# Altium project sliding_wheel.PrjPcb
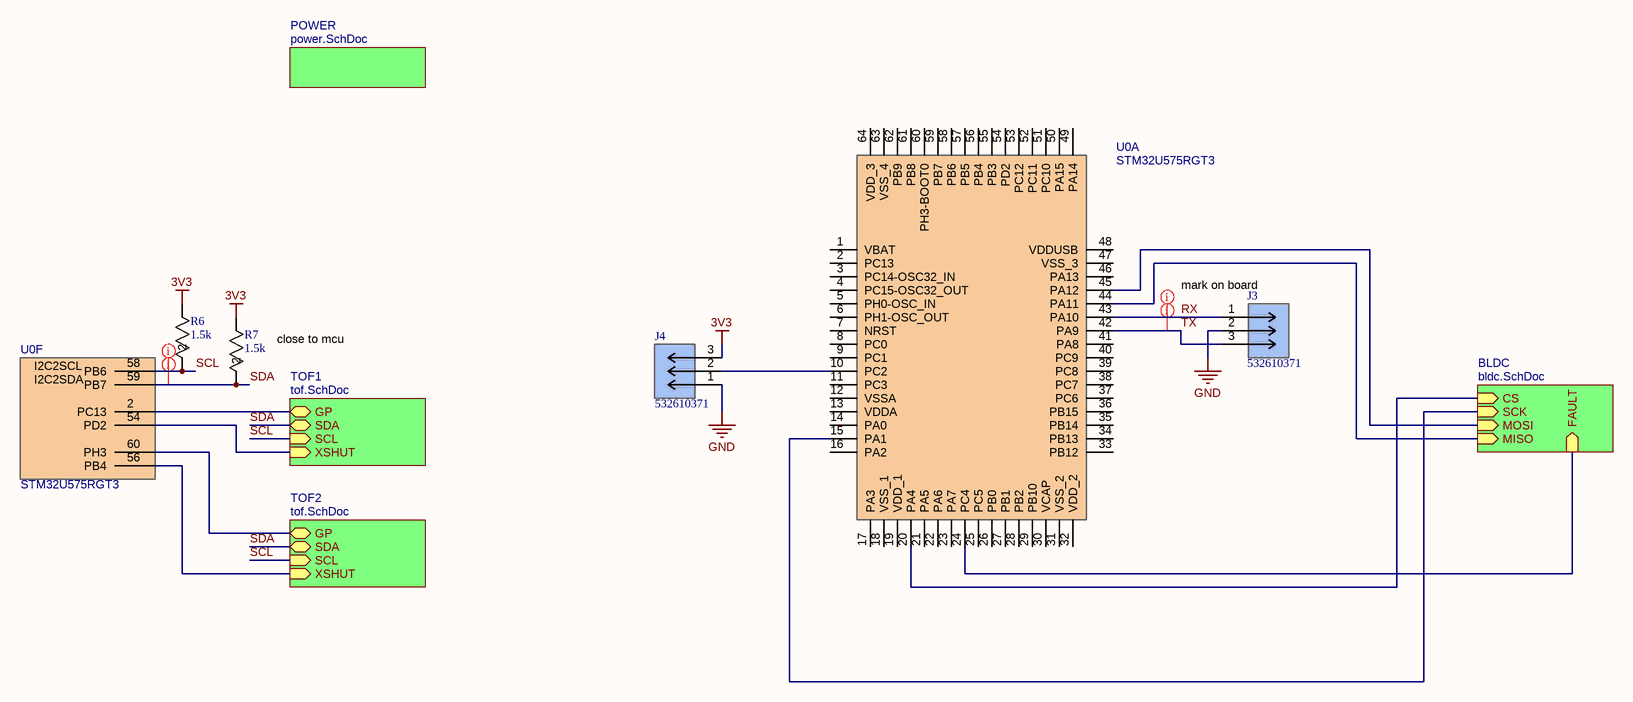
[diagram p0: main.SchDoc]
Author: Ben Posheng Cheng; Board: Sliding wheel
3 sheets, 55 parts. Net scope: hierarchical (ports join the sheet entries above them; power ports are global).
Board file: main.PcbDoc
Sheets:
  main.SchDoc
    BLDC = bldc.SchDoc
    POWER = power.SchDoc

## Sheet main.SchDoc
size Tabloid; SheetNumber: 1; SheetTotal: 4; Page: Main

### Parts
(Parts that share a designator on the sheet are numbered #1, #2 ... from top to bottom, then left to right.)
J3  532610371  [CONN_532610001-SD_03_MOL]
J4  532610371  [CONN_532610001-SD_03_MOL]
R6  1.5k  [RC0603N_YAG]
R7  1.5k  [RC0603N_YAG]
U0#1  STM32U575RGT3  [QFP50P1200X1200X160-64N]  (part A of 7)
U0#2  STM32U575RGT3  [QFP50P1200X1200X160-64N]  (part F of 6)

### Sub-sheets
BLDC = bldc.SchDoc: MISO (in), MOSI (in), SCK (in), CS (in), FAULT (in)
POWER = power.SchDoc: no entries
TOF1 = tof.SchDoc (file not in this document): GP (bidir), SDA (bidir), SCL (in), XSHUT (in)
TOF2 = tof.SchDoc (file not in this document): GP (bidir), SDA (bidir), SCL (in), XSHUT (in)

### Nets
3V3: J4.3 R6.1 R7.1
GND: J3.2 J4.1
CS: U0#1.20(PA4) ; sheet BLDC/CS
MOSI: U0#1.45(PA12) ; sheet BLDC/MOSI
RX: J3.1 U0#1.43(PA10)
SCL: R6.2 U0#2.58(PB6) ; sheet TOF1/SCL, sheet TOF2/SCL
SCL/SCK: U0#1.15(PA1) ; sheet BLDC/SCK
SDA: R7.2 U0#2.59(PB7) ; sheet TOF1/SDA, sheet TOF2/SDA
SDA/MISO: U0#1.44(PA11) ; sheet BLDC/MISO
TX: J3.3 U0#1.42(PA9)
NetJ4_2: J4.2 U0#1.10(PC2)
NetR12_2: U0#1.24(PC4) ; sheet BLDC/FAULT
NetU0#2_2: U0#2.2(PC13) ; sheet TOF1/GP
NetU0#2_54: U0#2.54(PD2) ; sheet TOF1/XSHUT
NetU0#2_56: U0#2.56(PB4) ; sheet TOF2/XSHUT
NetU0#2_60: U0#2.60(PH3) ; sheet TOF2/GP

Not connected (* = marked no-connect by the designer): U0#1 1(VBAT) 2(PC13) 3(PC14-OSC32_IN) 4(PC15-OSC32_OUT) 5(PH0-OSC_IN) 6(PH1-OSC_OUT) 7(NRST) 8(PC0) 9(PC1) 11(PC3) 12(VSSA) 13(VDDA) 14(PA0) 16(PA2) 17(PA3) 18(VSS_1) 19(VDD_1) 21(PA5) 22(PA6) 23(PA7) 25(PC5) 26(PB0) 27(PB1) 28(PB2) 29(PB10) 30(VCAP) 31(VSS_2) 32(VDD_2) 33(PB12) 34(PB13) 35(PB14) 36(PB15) 37(PC6) 38(PC7) 39(PC8) 40(PC9) 41(PA8) 46(PA13) 47(VSS_3) 48(VDDUSB) 49(PA14) 50(PA15) 51(PC10) 52(PC11) 53(PC12) 54(PD2) 55(PB3) 56(PB4) 57(PB5) 58(PB6) 59(PB7) 60(PH3-BOOT0) 61(PB8) 62(PB9) 63(VSS_4) 64(VDD_3)

### Layout directives
net class usart: RX, TX
net class i2c2: SCL, SDA

### Notes on the sheet
- (near J3) mark on board
- (near R7) close to mcu
- Board
- Page
- Author
- Date:
- File:
- (in symbol STM32U575RGT3, part F) I2C2SCL; I2C2SDA

### Library data of the parts
J3 J4 = 532610371: 1.25mm Pitch, PicoBlade PCB Header, Single Row, Right-Angle, Surface Mount, Tin (Sn) Plating, Friction Lock, 3 Circuits, Natural, Tape and Reel; Manufacturer_Name: Molex Connector Corporation; Copyright: Copyright (C) 2025 Ultra Librarian. All rights reserved.; Manufacturer_Part_Number: 532610371; RefDes: RefDes; Type: Type
R6 R7 = RC0603FR-071K5L: 1.5K OHM 1% 1/10W 0603; Manufacturer_Name: Yageo; Copyright: Copyright (C) 2026 Ultra Librarian. All rights reserved.; Manufacturer_Part_Number: RC0603FR-071K5L
U0#1 U0#2 = STM32U575RGT3: Ultra-low-power Arm Cortex-M33 32-bit MCU+TrustZone+FPU, 240 DMIPS, up to 2 MB Flash memory, 786 KB SRAM; Manufacturer_Name: STMicroelectronics; Geometry.Height: 1.6mm; Manufacturer_Part_Number: STM32U575RGT3; Mouser Part Number: *; Mouser Price/Stock: *; Arrow Part Number: *; Arrow Price/Stock: *; Datasheet Link: https://www.st.com/resource/en/datasheet/stm32u575ag.pdf

## Sheet bldc.SchDoc
size Tabloid; SheetNumber: 3; SheetTotal: 4; Page: BLDC
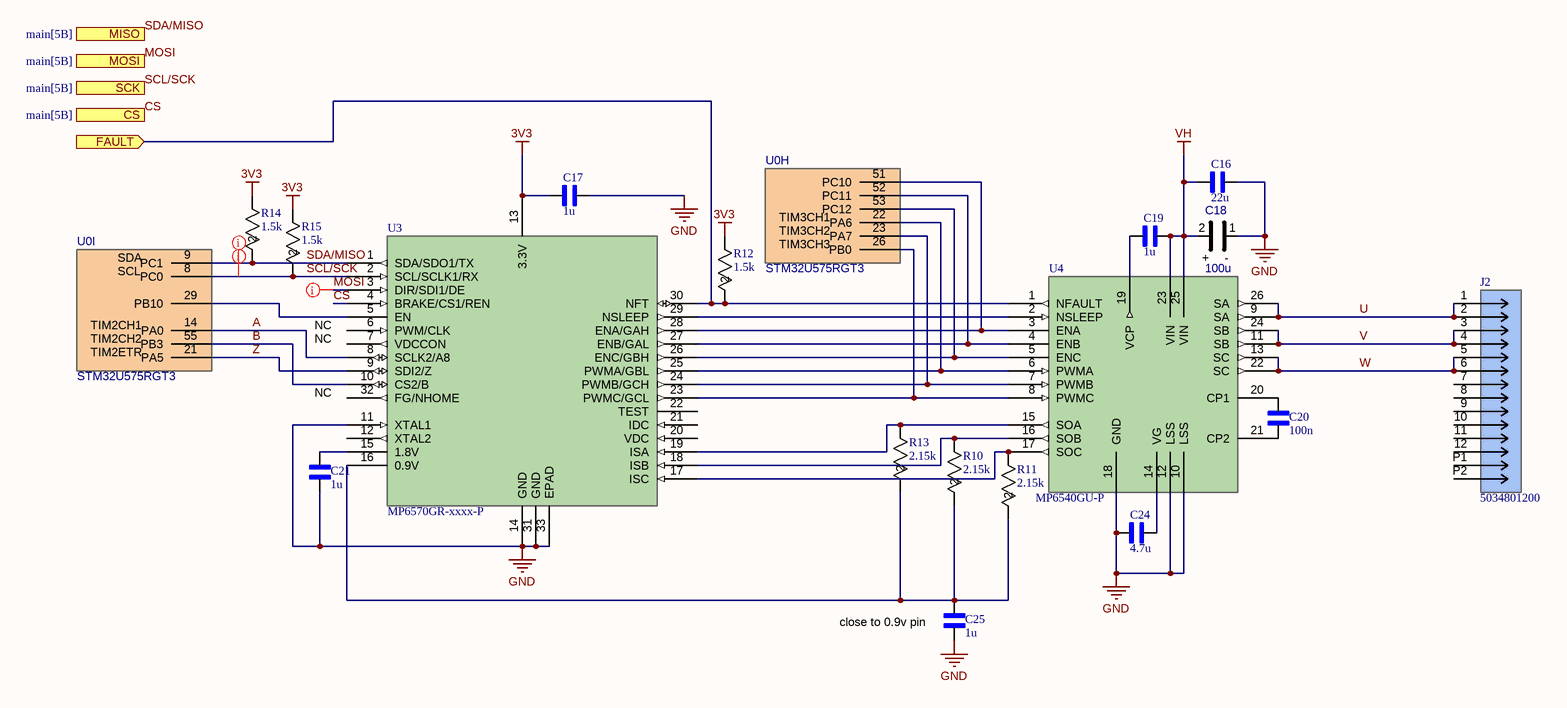
[diagram p1: bldc.SchDoc]

### Parts
(Parts that share a designator on the sheet are numbered #1, #2 ... from top to bottom, then left to right.)
C16  22u  [CAPC3225X270N]
C17  1u  [RC0603N_YAG]
C18  100u  [NICHICON63]
C19  1u  [RC0603N_YAG]
C20  100n  [CAPC1005X55N]
C21  1u  [RC0603N_YAG]
C24  4.7u  [CAPC2012X145N]
C25  1u  [RC0603N_YAG]
J2  5034801200  [CON_5034801200_MOL]
R10  2.15k  [RC0603N_YAG]
R11  2.15k  [RC0603N_YAG]
R12  1.5k  [RC0603N_YAG]
R13  2.15k  [RC0603N_YAG]
R14  1.5k  [RC0603N_YAG]
R15  1.5k  [RC0603N_YAG]
U0#3  STM32U575RGT3  [QFP50P1200X1200X160-64N]  (parts H,I of 10)
U3  MP6570GR-xxxx-P  [QFN-32_MP6570_MNP]
U4  MP6540GU-P  [QFN-5x5_MP6540_MNP]

### Ports
CS (in, see main[5B]), FAULT (in), MISO (in, see main[5B]), MOSI (in, see main[5B]), SCK (in, see main[5B])

### Nets
3V3: C17.2 R12.1 R14.1 R15.1 U3.13(3.3V)
GND: C16.2 C17.1 C18.1 C21.1 C24.2 C25.1 U3.11(XTAL1) U3.14(GND) U3.31(GND) U3.33(EPAD) U4.10(LSS) U4.12(LSS) U4.18(GND)
VH: C16.1 C18.2 C19.2 U4.23(VIN) U4.25(VIN)
A: U0#3.14(PA0) U3.8(SCLK2/A8)
B: U0#3.55(PB3) U3.10(CS2/B)
CS: U3.4(BRAKE/CS1/REN) ; port CS
MOSI: U3.3(DIR/SDI1/DE) ; port MOSI
SCL/SCK: R15.2 U0#3.8(PC0) U3.2(SCL/SCLK1/RX) ; port SCK
SDA/MISO: R14.2 U0#3.9(PC1) U3.1(SDA/SDO1/TX) ; port MISO
U: J2.1 J2.2 U4.9(SA) U4.26(SA)
V: J2.3 J2.4 U4.11(SB) U4.24(SB)
W: J2.5 J2.6 U4.13(SC) U4.22(SC)
Z: U0#3.21(PA5) U3.9(SDI2/Z)
NetC19_1: C19.1 U4.19(VCP)
NetC20_1: C20.1 U4.21(CP2)
NetC20_2: C20.2 U4.20(CP1)
NetC21_2: C21.2 U3.15(1.8V)
NetC24_1: C24.1 U4.14(VG)
NetC25_2: C25.2 R10.2 R11.2 R13.2 U3.16(0.9V)
NetR10_1: R10.1 U3.18(ISB) U4.16(SOB)
NetR11_1: R11.1 U3.17(ISC) U4.17(SOC)
NetR12_2: R12.2 U3.30(NFT) U4.1(NFAULT) ; port FAULT
NetR13_1: R13.1 U3.19(ISA) U4.15(SOA)
NetU0#3_22: U0#3.22(PA6) U3.25(PWMA/GBL) U4.6(PWMA)
NetU0#3_23: U0#3.23(PA7) U3.24(PWMB/GCH) U4.7(PWMB)
NetU0#3_26: U0#3.26(PB0) U3.23(PWMC/GCL) U4.8(PWMC)
NetU0#3_29: U0#3.29(PB10) U3.5(EN)
NetU0#3_51: U0#3.51(PC10) U3.28(ENA/GAH) U4.3(ENA)
NetU0#3_52: U0#3.52(PC11) U3.27(ENB/GAL) U4.4(ENB)
NetU0#3_53: U0#3.53(PC12) U3.26(ENC/GBH) U4.5(ENC)
NetU3_29: U3.29(NSLEEP) U4.2(NSLEEP)

Not connected (* = marked no-connect by the designer): J2 7 8 9 10 11 12 P1 P2; U3 6(PWM/CLK) 7(VDCCON) 12(XTAL2) 20(VDC) 21(IDC) 22(TEST) 32(FG/NHOME)

### Layout directives
net class i2c3/spi1: MOSI, SCL/SCK, SDA/MISO

### Notes on the sheet
- NC
- (near C25) close to 0.9v pin
- Board
- Page
- Author
- Date:
- File:
- (in symbol STM32U575RGT3, part H) TIM3CH1; TIM3CH2; TIM3CH3
- (in symbol STM32U575RGT3, part I) SDA; SCL; TIM2CH1; TIM2CH2; TIM2ETR
- (in symbol UCM1V101MCL1GS) +; -
- (in symbol STM32U575RGT3, part K) TIM3CH1; TIM3CH2; TIM3CH3
- (in symbol STM32U575RGT3, part E) MISO; TIM3CH1; MOSI; TIM3CH2; CS; TIM3CH3; SCL; TIM3CH4; TIM5CH2; TIM2CH1; TIM5CH3; TIM2CH2; TIM2ETR

### Library data of the parts
C16 = MSAST32MSB7226KPNB25: CAP CER 22UF 25V X7R 1210; MF: {'manufacturer': u'Taiyo Yuden'}; Package: None; Price: None; Value: *; MP: MSAST32MSB7226KPNB25; Availability: Unavailable; Manufacturer_Part_Number: MSAST32MSB7226KPNB25
C17 C19 C21 C25 = EMK107B7105KA-T: CAP CER 1UF 16V X7R 0603; MF: {'manufacturer': u'Taiyo Yuden'}; Package: None; Price: None; Value: *; MP: EMK107B7105KA-T; Availability: Unavailable; Manufacturer_Part_Number: EMK107B7105KA-T
C18 = UCM1V101MCL1GS: 100uF 35V; Manufacturer_Part_Number: UCM1V101MCL1GS
C20 = UMK105B7104KVHF: CAP CER 0.1UF 50V X7R 0402; MF: {'manufacturer': u'Taiyo Yuden'}; Package: None; Price: None; Value: *; MP: UMK105B7104KVHF; Availability: Unavailable; Manufacturer_Part_Number: UMK105B7104KVHF
C24 = EMK212B7475KG-T: CAP CER 4.7UF 16V X7R 0805; MF: {'manufacturer': u'Taiyo Yuden'}; Package: None; Price: None; Value: *; MP: EMK212B7475KG-T; Availability: Unavailable; Manufacturer_Part_Number: EMK212B7475KG-T
J2 = 5034801200: Easy-On FFC/FPC Connector, 0.50mm Pitch, FBH1 Series, Right-Angle, Dual Contact, 1.00mm Height, 12 Circuits, Gold over Nickel Plating; Manufacturer_Name: Molex Connector Corporation; Copyright: Copyright (C) 2026 Ultra Librarian. All rights reserved.; Manufacturer_Part_Number: 5034801200; RefDes: RefDes; Type: Type
R10 R11 R13 = RT0603BRE072K15L: 2.15K OHM 0.1% 1/10W 0603; Manufacturer_Name: Yageo; Copyright: Copyright (C) 2026 Ultra Librarian. All rights reserved.; Manufacturer_Part_Number: RT0603BRE072K15L
R12 R14 R15 = RC0603FR-071K5L: as R6 on sheet main; Copyright: Copyright (C) 2026 Ultra Librarian. All rights reserved.; Manufacturer_Part_Number: RC0603FR-071K5L
U0#3 = STM32U575RGT3: as U0#1 on sheet main; Manufacturer_Part_Number: STM32U575RGT3; Mouser Part Number: *; Mouser Price/Stock: *; Arrow Part Number: *; Arrow Price/Stock: *; Datasheet Link: https://www.st.com/resource/en/datasheet/stm32u575ag.pdf
U3 = MP6570GR-xxxx-P: 3-Phase BLDC Controller with aHigh-Accuracy Angular Sensor; Manufacturer_Name: Monolithic Power Systems; Copyright: Copyright (C) 2026 Ultra Librarian. All rights reserved.; Manufacturer_Part_Number: MP6570GR-xxxx-P; RefDes: RefDes; Type: Type
U4 = MP6540GU-P: 35V 3A Three-Phase Power Stage; Manufacturer_Name: Monolithic Power Systems; Copyright: Copyright (C) 2025 Ultra Librarian. All rights reserved.; Manufacturer_Part_Number: MP6540GU-P; RefDes: RefDes; Type: Type

## Sheet power.SchDoc
size Tabloid; SheetNumber: 2; SheetTotal: 4; Page: Power
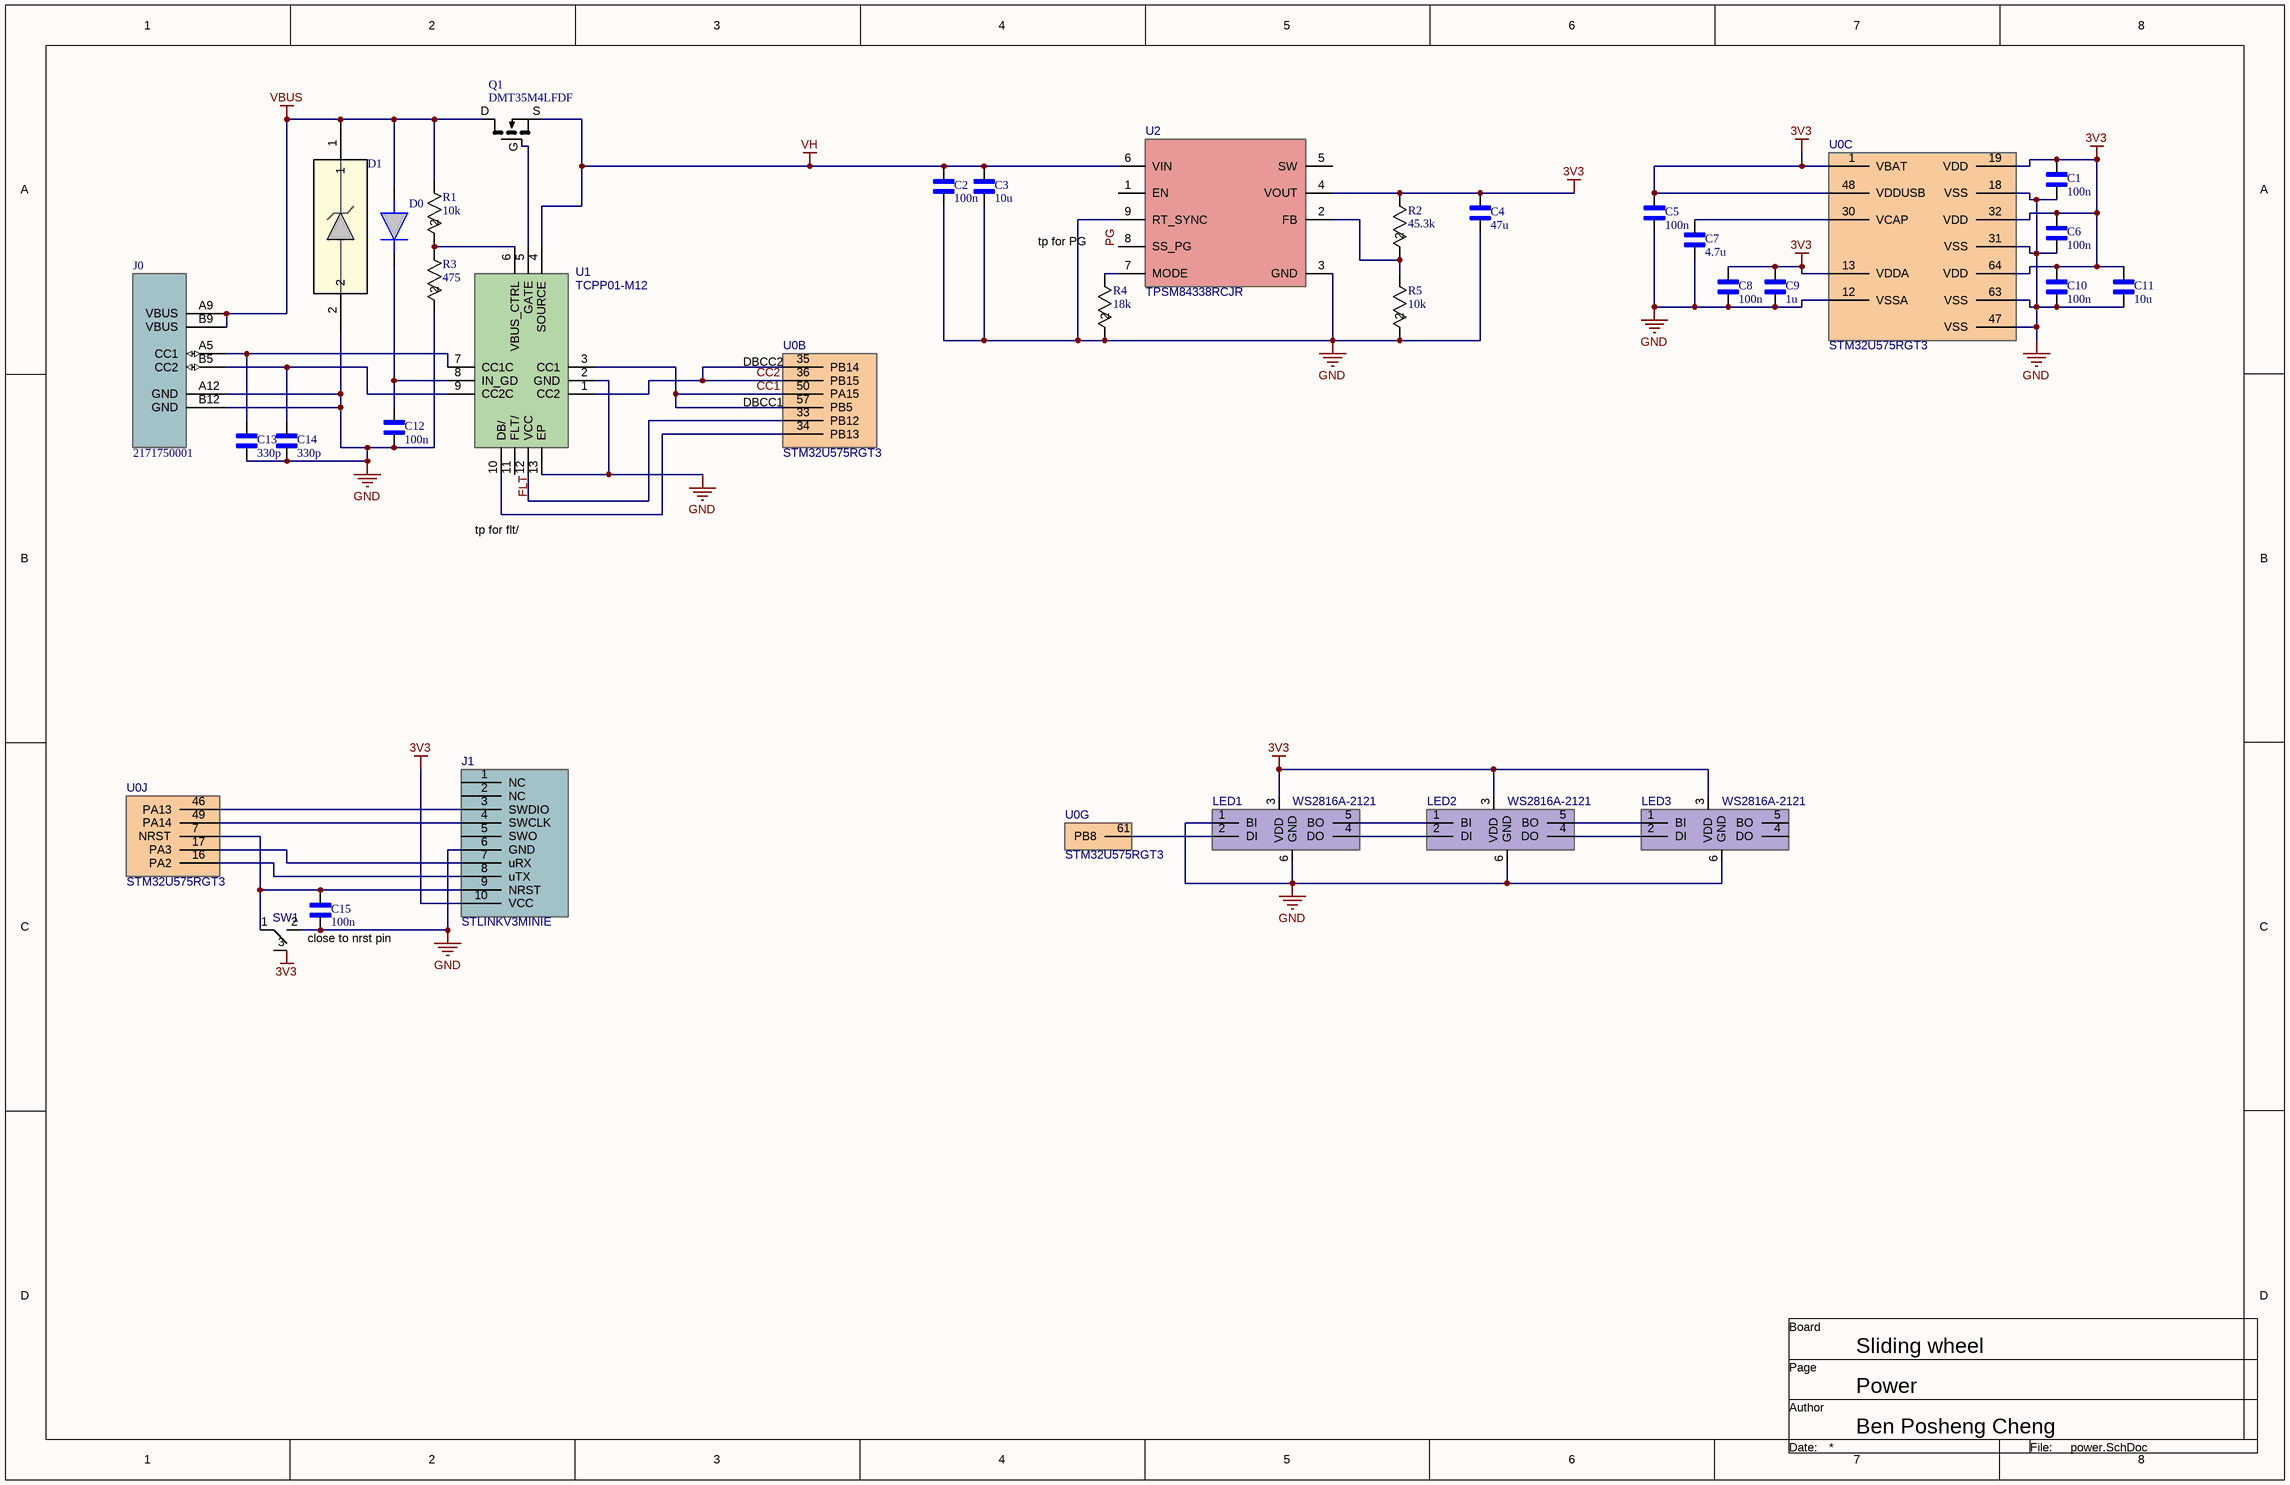
[diagram p2: power.SchDoc]

### Parts
(Parts that share a designator on the sheet are numbered #1, #2 ... from top to bottom, then left to right.)
C1  100n  [CAPC1005X55N]
C2  100n  [CAPC1005X55N]
C3  10u  [CAPC3225X270N]
C4  47u  [CAPC2012X145N]
C5  100n  [CAPC1005X55N]
C6  100n  [CAPC1005X55N]
C7  4.7u  [CAPC1005X55N]
C8  100n  [CAPC1005X55N]
C9  1u  [CAPC1005X55N]
C10  100n  [CAPC1005X55N]
C11  10u  [CAPC1005X55N]
C12  100n  [CAPC1005X55N]
C13  330p  [CAPC1005X55N]
C14  330p  [CAPC1005X55N]
C15  100n  [CAPC1005X55N]
D0  BAT54KFILM  [SODFL1608X70N]  (value not drawn)
D1  ESDA25P35-1U1M  [QFN1610_STM]  (value not drawn)
J0  2171750001  [2171750001_MOL]
J1  STLINKV3MINIE  [009159010061911]
LED1  WS2816A-2121  [ws2816a-2121]
LED2  WS2816A-2121  [ws2816a-2121]
LED3  WS2816A-2121  [ws2816a-2121]
Q1  DMT35M4LFDF  [U-DFN2020-6 (Type F)]
R1  10k  [RC0603N_YAG]
R2  45.3k  [RC0603N_YAG]
R3  475  [RC0603N_YAG]
R4  18k  [RC0603N_YAG]
R5  10k  [RC0603N_YAG]
SW1  B3U-3100P-B  [B3U3000PB]  (value not drawn)
U0#3  STM32U575RGT3  [QFP50P1200X1200X160-64N]  (parts B,C,G,J of 10)
U1  TCPP01-M12  [QFN50P300X300X100-13N-D]
U2  TPSM84338RCJR  [RCJ0009A-MFG]

### Nets
3V3: C1.2 C4.2 C5.2 C6.2 C8.2 C9.2 C10.2 C11.2 J1.10(VCC) LED1.3(VDD) LED2.3(VDD) LED3.3(VDD) R2.1 SW1.3 U0#3.1(VBAT) U0#3.13(VDDA) U0#3.19(VDD) U0#3.32(VDD) U0#3.48(VDDUSB) U0#3.64(VDD) U2.4(VOUT)
GND: C1.1 C2.1 C3.1 C4.1 C5.1 C6.1 C7.1 C8.1 C9.1 C10.1 C11.1 C12.1 C13.1 C14.1 C15.1 D1.2 J0.A12(GND) J0.B12(GND) J1.6(GND) LED1.1(BI) LED1.6(GND) LED2.6(GND) LED3.6(GND) R3.2 R4.2 R5.2 SW1.2(N.O.) U0#3.12(VSSA) U0#3.18(VSS) U0#3.31(VSS) U0#3.47(VSS) U0#3.63(VSS) U1.2(GND) U1.13(EP) U2.3(GND) U2.9(RT_SYNC)
VBUS: D0.2(A) D1.1 J0.A9(VBUS) J0.B9(VBUS) Q1.D R1.1
VH: C2.2 C3.2 Q1.S U1.4(SOURCE) U2.6(VIN)
CC1: U0#3.50(PA15) U0#3.57(PB5) U1.3(CC1)
CC2: U0#3.35(PB14) U0#3.36(PB15) U1.1(CC2)
FLT: U1.11(FLT/)
PG: U2.8(SS_PG)
NetC7_2: C7.2 U0#3.30(VCAP)
NetC12_2: C12.2 D0.1(K) U1.8(IN_GD)
NetC13_2: C13.2 J0.A5(CC1) U1.7(CC1C)
NetC14_2: C14.2 J0.B5(CC2) U1.9(CC2C)
NetC15_2: C15.2 J1.9(NRST) SW1.1(COM) U0#3.7(NRST)
NetJ1_3: J1.3(SWDIO) U0#3.46(PA13)
NetJ1_4: J1.4(SWCLK) U0#3.49(PA14)
NetJ1_7: J1.7(uRX) U0#3.17(PA3)
NetJ1_8: J1.8(uTX) U0#3.16(PA2)
NetLED1_2: LED1.2(DI) U0#3.61(PB8)
NetLED1_4: LED1.4(DO) LED2.2(DI)
NetLED1_5: LED1.5(BO) LED2.1(BI)
NetLED2_4: LED2.4(DO) LED3.2(DI)
NetLED2_5: LED2.5(BO) LED3.1(BI)
NetQ1_G: Q1.G U1.5(GATE)
NetR1_2: R1.2 R3.1 U1.6(VBUS_CTRL)
NetR2_2: R2.2 R5.1 U2.2(FB)
NetR4_1: R4.1 U2.7(MODE)
NetU0#3_33: U0#3.33(PB12) U1.12(VCC)
NetU0#3_34: U0#3.34(PB13) U1.10(DB/)

Not connected (* = marked no-connect by the designer): J1 1(NC) 2(NC) 5(SWO); LED3 4(DO) 5(BO); U2 1(EN) 5(SW)

### Notes on the sheet
- tp for PG
- (near U0#3) DBCC2
- (near U0#3) DBCC1
- tp for flt/
- close to nrst pin
- Board
- Page
- Author
- Date:
- File:

### Library data of the parts
C1 C2 C5 C6 C8 C10 C12 C15 = UMK105B7104KVHF: as C20 on sheet bldc; Package: None; Price: None; Value: *; MP: UMK105B7104KVHF; Availability: Unavailable; Manufacturer_Part_Number: UMK105B7104KVHF
C3 = MSASU32MSB5106KPNA01: CAP CER 10UF 50V X5R 1210; MF: {'manufacturer': u'Taiyo Yuden'}; Package: None; Price: None; Value: *; MP: MSASU32MSB5106KPNA01; Availability: Unavailable; Manufacturer_Part_Number: MSASU32MSB5106KPNA01
C4 = MSASL21GBB5476MTNA01: CAP CER 47UF 10V X5R 0805; MF: {'manufacturer': u'Taiyo Yuden'}; Package: None; Price: None; Value: *; MP: MSASL21GBB5476MTNA01; Availability: Unavailable; Manufacturer_Part_Number: MSASL21GBB5476MTNA01
C7 = GRM155R60J475M: CAP CER 4.7UF 6.3V X5R 0402; MF: {'manufacturer': u'Taiyo Yuden'}; Package: None; Price: None; Value: *; MP: GRM155R60J475M; Availability: Unavailable; Manufacturer_Part_Number: GRM155R60J475M
C9 = GRM155R60J105K: CAP CER 1UF 6.3V X5R 0402; MF: {'manufacturer': u'Taiyo Yuden'}; Package: None; Price: None; Value: *; MP: GRM155R60J105K; Availability: Unavailable; Manufacturer_Part_Number: GRM155R60J105K
C11 = GRM155R60J106M: CAP CER 10UF 6.3V X5R 0402; MF: {'manufacturer': u'Taiyo Yuden'}; Package: None; Price: None; Value: *; MP: GRM155R60J106M; Availability: Unavailable; Manufacturer_Part_Number: GRM155R60J106M
C13 C14 = MCASU105SCG331JFNA01: CAP CER 330PF 50V C0G 0402; MF: {'manufacturer': u'Taiyo Yuden'}; Package: None; Price: None; Value: *; MP: MCASU105SCG331JFNA01; Availability: Unavailable; Manufacturer_Part_Number: MCASU105SCG331JFNA01
D0 = BAT54KFILM: BAT54KFILM, Schottky Diode,  0.3A max, 40V 5ns, 2-Pin, SOD-523; Manufacturer_Name: STMicroelectronics; Geometry.Height: 0.7mm; Manufacturer_Part_Number: BAT54KFILM; Mouser Part Number: 511-BAT54KFILM; Mouser Price/Stock: https://www.mouser.co.uk/ProductDetail/STMicroelectronics/BAT54KFILM?qs=jZi1jxfVU95Y9ce6l3OT%252BA%3D%3D; Arrow Part Number: BAT54KFILM; Arrow Price/Stock: https://www.arrow.com/en/products/bat54kfilm/stmicroelectronics?region=europe; Datasheet Link: https://www.st.com/resource/en/datasheet/bat54.pdf
D1 = ESDA25P35-1U1M: 35 A - 8/20 us, 22 V TVS in QFN-2L; Manufacturer_Name: STMicroelectronics; Copyright: Copyright (C) 2026 Ultra Librarian. All rights reserved.; Manufacturer_Part_Number: ESDA25P35-1U1M; RefDes: RefDes; Type: Type
J0 = 2171750001: Universal Serial Bus (USB) Shielded I/O Receptacle, Type C, Right-Angle,  Surface Mount, Top Mount, 6 Circuits, Gold (Au) Plating; Manufacturer_Name: Molex Connector Corporation; Copyright: Copyright (C) 2025 Ultra Librarian. All rights reserved.; Manufacturer_Part_Number: 2171750001; RefDes: RefDes; Type: Type
J1 = 009159010061911: KYOCERA-AVX 009159010061911
R1 R5 = RT0603BRD0710KL: 10K OHM 0.1% 1/10W 0603; Manufacturer_Name: Yageo; Copyright: Copyright (C) 2026 Ultra Librarian. All rights reserved.; Manufacturer_Part_Number: RT0603BRD0710KL
R2 = RT0603BRD0745K3L: 45.3K OHM 0.1% 1/10W 0603; Manufacturer_Name: Yageo; Copyright: Copyright (C) 2026 Ultra Librarian. All rights reserved.; Manufacturer_Part_Number: RT0603BRD0745K3L
R3 = RT0603BRE07475RL: 475 OHM 0.1% 1/10W 0603; Manufacturer_Name: Yageo; Copyright: Copyright (C) 2026 Ultra Librarian. All rights reserved.; Manufacturer_Part_Number: RT0603BRE07475RL
R4 = RT0603BRD0718KL: 18K OHM 0.1% 1/10W 0603; Manufacturer_Name: Yageo; Copyright: Copyright (C) 2026 Ultra Librarian. All rights reserved.; Manufacturer_Part_Number: RT0603BRD0718KL
SW1 = B3U-3100P-B: OMRON - B3U-3100P-B - TACTILE SWITCH, SIDE ACTUATED, SMD; Manufacturer_Name: OMRON Electronics; Geometry.Height: 1.35mm; Manufacturer_Part_Number: B3U-3100P-B; Mouser Part Number: 653-B3U-3000P-B; Mouser Price/Stock: https://www.mouser.co.uk/ProductDetail/Omron-Electronics/B3U-3000P-B?qs=AO7BQMcsEu4JAdtnbsGArA%3D%3D; Arrow Part Number: B3U-3000P-B; Arrow Price/Stock: https://www.arrow.com/en/products/b3u-3000p-b/omron?utm_currency=USD&region=nac; Datasheet Link: https://componentsearchengine.com/Datasheets/2/B3U-3000P-B.pdf
U0#3 = STM32U575RGT3: as U0#1 on sheet main; Manufacturer_Part_Number: STM32U575RGT3; Mouser Part Number: *; Mouser Price/Stock: *; Arrow Part Number: *; Arrow Price/Stock: *; Datasheet Link: https://www.st.com/resource/en/datasheet/stm32u575ag.pdf
U1 = TCPP01-M12: USB Type-C and power delivery protection for sink application; Manufacturer_Name: STMicroelectronics; Geometry.Height: 1mm; Manufacturer_Part_Number: TCPP01-M12; Mouser Part Number: 511-TCPP01-M12; Mouser Price/Stock: https://www.mouser.co.uk/ProductDetail/STMicroelectronics/TCPP01-M12?qs=%252B6g0mu59x7KCafIwapwG2A%3D%3D; Arrow Part Number: TCPP01-M12; Arrow Price/Stock: https://www.arrow.com/en/products/tcpp01-m12/stmicroelectronics.html?utm_currency=USD&region=europe; Datasheet Link: https://www.st.com/resource/en/datasheet/tcpp01-m12.pdf
U2 = TPSM84338RCJR: 3.8-V to 28-V Input, 3A, 200kHz-2.2MHz synchronous step-down power module 9-QFN-FCMOD -40 to 125; Manufacturer_Name: Texas Instruments; TYPE: TYPE; RefDes: RefDes; Copyright: Copyright (C) 2025 Ultra Librarian. All rights reserved.; Manufacturer_Part_Number: TPSM84338RCJR
LED1-LED3 = WS2816A-2121: Manufacturer_Part_Number: WS2816A-2121
Q1 = DMT35M4LFDF: Manufacturer_Part_Number: DMT35M4LFDF

## Nets that join several sheets
3V3: main (J4.3 R6.1 R7.1), bldc (5 pins), power (21 pins)
GND: main (J3.2 J4.1), bldc (13 pins), power (36 pins)
VH: bldc (5 pins), power (5 pins)
CS: main (U0#1.20), bldc (U3.4)
MOSI: main (U0#1.45), bldc (U3.3)
NetR12_2: main (U0#1.24), bldc (R12.2 U3.30 U4.1)
SCL/SCK: main (U0#1.15), bldc (R15.2 U0#3.8 U3.2)
SDA/MISO: main (U0#1.44), bldc (R14.2 U0#3.9 U3.1)